# Altium schematic sheet 第一路电压隔离原理图.SchDoc
size A4
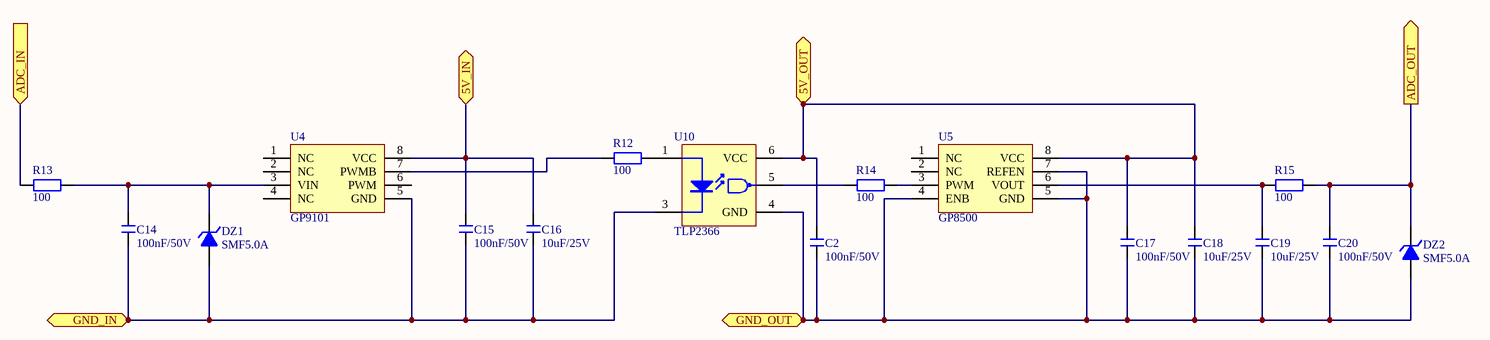
[diagram p0: 第一路电压隔离原理图.SchDoc]

## Parts
C2  100nF/50V  [C 0603_M]
C14  100nF/50V  [C 0603_M]
C15  100nF/50V  [C 0603_M]
C16  10uF/25V  [C 0603_M]
C17  100nF/50V  [C 0603_M]
C18  10uF/25V  [C 0603_M]
C19  10uF/25V  [C 0603_M]
C20  100nF/50V  [C 0603_M]
DZ1  SMF5.0A  [SOD-123]
DZ2  SMF5.0A  [SOD-123]
R12  100  [R 0603_M]
R13  100  [R 0603_M]
R14  100  [R 0603_M]
R15  100  [R 0603_M]
U4  GP9101  [SOP8_N]
U5  GP8500  [SOP8_N]
U10  TLP2366  [SOP5_N]

## Ports
5V_IN (bidir), 5V_OUT (bidir), ADC_IN (in), ADC_OUT (out), GND_IN (bidir), GND_OUT (bidir)

## Nets
5V_IN: C15.2 C16.2 U4.8(VCC) ; port 5V_IN
5V_OUT: C2.2 C17.2 C18.2 U5.8(VCC) U10.6(VCC) ; port 5V_OUT
ADC_IN: R13.1 ; port ADC_IN
ADC_OUT: C20.2 DZ2.2(K) R15.2 ; port ADC_OUT
GND_IN: C14.1 C15.1 C16.1 DZ1.1(A) U4.5(GND) U10.3(LED-) ; port GND_IN
GND_OUT: C2.1 C17.1 C18.1 C19.1 C20.1 DZ2.1(A) U5.4(ENB) U5.5(GND) U5.7(REFEN) U10.4(GND) ; port GND_OUT
NetC14_2: C14.2 DZ1.2(K) R13.2 U4.3(VIN)
NetC19_2: C19.2 R15.1 U5.6(VOUT)
NetR12_1: R12.1 U4.7(PWMB)
NetR12_2: R12.2 U10.1(LED+)
NetR14_1: R14.1 U10.5(GND)
NetR14_2: R14.2 U5.3(PWM)

Not connected (* = marked no-connect by the designer): U4 1(NC) 2(NC) 4(NC) 6(PWM); U5 1(NC) 2(NC)

## Library data of the parts
C2 C14-C20 = C: 无极性贴片电容; 版权归属: 源创客; 材质: X7R; BOM名称: 无极性贴片电容; 学习资源: www.ooocke.com
DZ1 DZ2 = 1N4620: 3.3V/0.5W稳压管; 版权归属: 源创客; BOM名称: 3.3V/0.5W稳压管; 学习资源: www.ooocke.com
R12-R15 = R: 贴片电阻; 版权归属: 源创客; BOM名称: 贴片电阻; 学习资源: www.ooocke.com
U4 = GP9101: 将0V到VCC的模拟电压输入，线性转换成0%-100%占  空比的PWM信号输出
U5 = GP8500: 0%-100% PWM 转 0-2.5V/0-VCC
U10 = TLP2366: 单路高速光耦